# EAGLE design Salinity-FeatherWing (EAGLE 7.5.0)
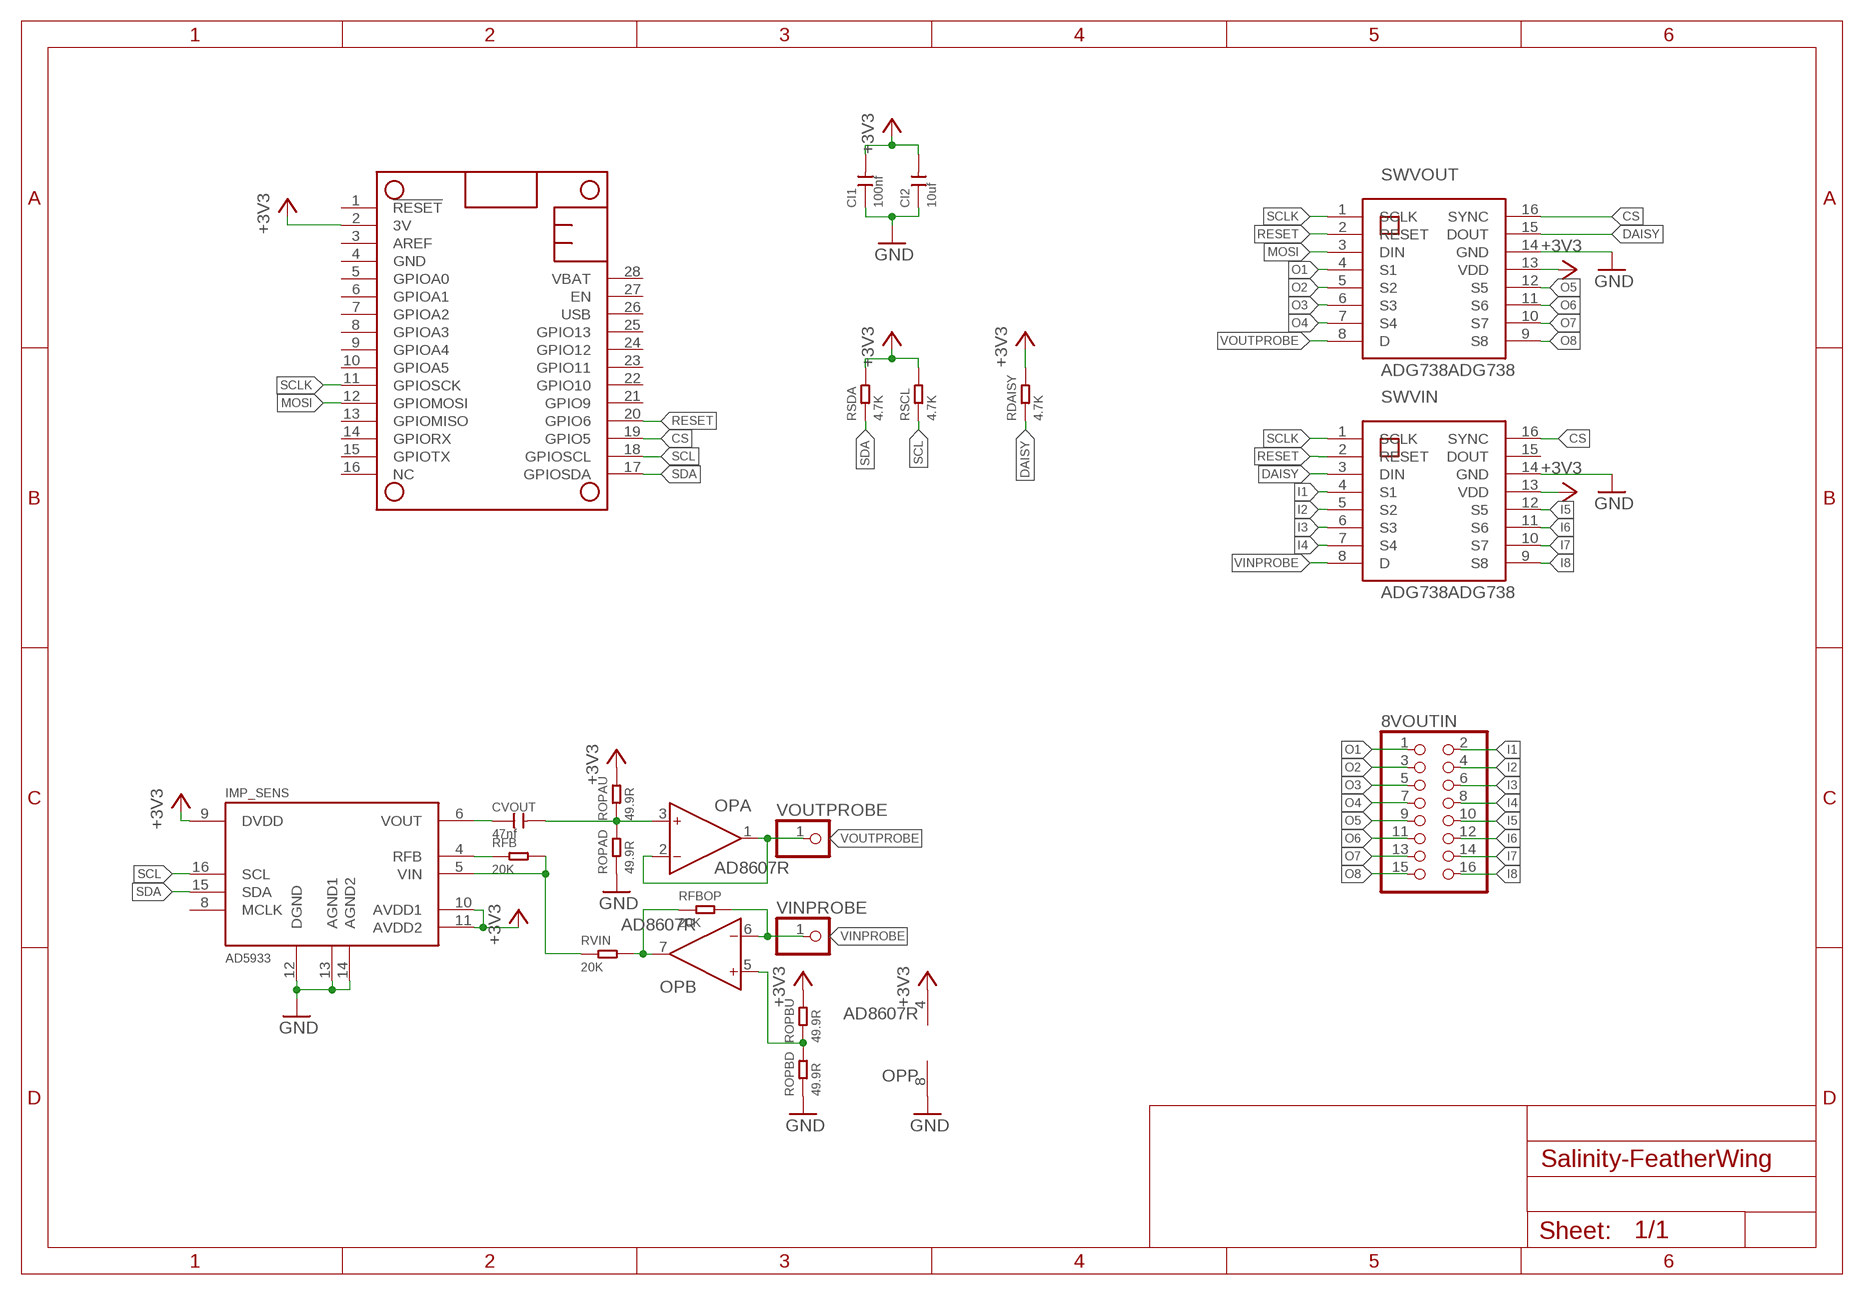
[diagram p0: schematic, sheet 1]

## Parts
8VOUTIN  PINHD-2X8/90  [2X08/90]
CI1  100nf  CERAMIC-100NF-50V-10%-X7R(0603)  [C0603]
CI2  10uf  CERAMIC-10UF-10V-10%-X5R(0603)  [C0603]
CVOUT  47nf  CERAMIC-47NF-25V-10%-X7R(0402)  [C0402]
IMP_SENS  AD5933  [SSOP16]
MS1  FEATHERWING  [FEATHERWING]
OP  AD8607R  [SO8]
RDAISY  4.7K  SMD-RES-4.7K-5%-1/10W(0603)  [R0603]
RFB  20K  SMD-RES-20K-1%-1/10W(0603)  [R0603]
RFBOP  20K  SMD-RES-20K-1%-1/10W(0603)  [R0603]
ROPAD  49.9R  SMD-RES-49.9R-1%-1/10W(0603)  [R0603]
ROPAU  49.9R  SMD-RES-49.9R-1%-1/10W(0603)  [R0603]
ROPBD  49.9R  SMD-RES-49.9R-1%-1/10W(0603)  [R0603]
ROPBU  49.9R  SMD-RES-49.9R-1%-1/10W(0603)  [R0603]
RSCL  4.7K  SMD-RES-4.7K-5%-1/10W(0603)  [R0603]
RSDA  4.7K  SMD-RES-4.7K-5%-1/10W(0603)  [R0603]
RVIN  20K  SMD-RES-20K-1%-1/10W(0603)  [R0603]
SWVIN  ADG738ADG738  [TSSOP16]
SWVOUT  ADG738ADG738  [TSSOP16]
VINPROBE  PINHD-1X1  [1X01]
VOUTPROBE  PINHD-1X1  [1X01]

## Nets
+3V3: CI1.2 CI2.2 IMP_SENS.9(DVDD) IMP_SENS.10(AVDD1) IMP_SENS.11(AVDD2) MS1.2(3V) OP.4(P:V-) RDAISY.2 ROPAU.2 ROPBU.2 RSCL.2 RSDA.2 SWVIN.13(VDD) SWVOUT.13(VDD)
CS: MS1.19(GPIO5) SWVIN.16(SYNC) SWVOUT.16(SYNC)
DAISY: RDAISY.1 SWVIN.3(DIN) SWVOUT.15(DOUT)
GND: CI1.1 CI2.1 IMP_SENS.12(DGND) IMP_SENS.13(AGND1) IMP_SENS.14(AGND2) OP.8(P:V+) ROPAD.1 ROPBD.1 SWVIN.14(GND) SWVOUT.14(GND)
I1: 8VOUTIN.2 SWVIN.4(S1)
I2: 8VOUTIN.4 SWVIN.5(S2)
I3: 8VOUTIN.6 SWVIN.6(S3)
I4: 8VOUTIN.8 SWVIN.7(S4)
I5: 8VOUTIN.10 SWVIN.12(S5)
I6: 8VOUTIN.12 SWVIN.11(S6)
I7: 8VOUTIN.14 SWVIN.10(S7)
I8: 8VOUTIN.16 SWVIN.9(S8)
MOSI: MS1.12(GPIOMOSI) SWVOUT.3(DIN)
N$2: OP.7(B:OUT) RFBOP.1 RVIN.2
N$4: IMP_SENS.4(RFB) RFB.1
N$5: IMP_SENS.5(VIN) RFB.2 RVIN.1
N$6: CVOUT.1 IMP_SENS.6(VOUT)
O1: 8VOUTIN.1 SWVOUT.4(S1)
O2: 8VOUTIN.3 SWVOUT.5(S2)
O3: 8VOUTIN.5 SWVOUT.6(S3)
O4: 8VOUTIN.7 SWVOUT.7(S4)
O5: 8VOUTIN.9 SWVOUT.12(S5)
O6: 8VOUTIN.11 SWVOUT.11(S6)
O7: 8VOUTIN.13 SWVOUT.10(S7)
O8: 8VOUTIN.15 SWVOUT.9(S8)
OPA+: CVOUT.2 OP.3(A:IN+) ROPAD.2 ROPAU.1
OPB+: OP.5(B:IN+) ROPBD.2 ROPBU.1
RESET: MS1.20(GPIO6) SWVIN.2(RESET) SWVOUT.2(RESET)
SCL: IMP_SENS.16(SCL) MS1.18(GPIOSCL) RSCL.1
SCLK: MS1.11(GPIOSCK) SWVIN.1(SCLK) SWVOUT.1(SCLK)
SDA: IMP_SENS.15(SDA) MS1.17(GPIOSDA) RSDA.1
VINPROBE: OP.6(B:IN-) RFBOP.2 SWVIN.8(D) VINPROBE.1
VOUTPROBE: OP.1(A:OUT) OP.2(A:IN-) SWVOUT.8(D) VOUTPROBE.1
Unconnected: IMP_SENS.8(MCLK) MS1.1(!RESET) MS1.3(AREF) MS1.5(GPIOA0) MS1.6(GPIOA1) MS1.7(GPIOA2) MS1.8(GPIOA3) MS1.9(GPIOA4) MS1.10(GPIOA5) MS1.13(GPIOMISO) MS1.14(GPIORX) MS1.15(GPIOTX) MS1.16(NC) MS1.21(GPIO9) MS1.22(GPIO10) MS1.23(GPIO11) MS1.24(GPIO12) MS1.25(GPIO13) MS1.26(USB) MS1.27(EN) MS1.28(VBAT) SWVIN.15(DOUT)

## Power pins joined to a net without a drawn wire
GND: MS1.4(GND)

## Library data of the parts
8VOUTIN = pinhead:PINHD-2X8: PIN HEADER
CI1 = Seeed-OPL-Capacitor:CERAMIC-100NF-50V-10%-X7R(0603): 302010138; MPN: CC0603KRX7R9BB104
CI2 = Seeed-OPL-Capacitor:CERAMIC-10UF-10V-10%-X5R(0603): 302010103; MPN: CC0603KRX5R6BB106
CVOUT = Seeed-OPL-Capacitor:CERAMIC-47NF-25V-10%-X7R(0402): 302010002; MPN: CC0402KRX7R8BB473
IMP_SENS = kblom:AD5933: 1 MSPS, 12-Bit Impedance Converter, Network Analyzer Applications: Electrochemical analysis Bioelectrical impedance analysis Impedance spectroscopy Complex impedance measurement Corrosion monitoring and protection equipment Biomedical and automotive sensors Proximity sensing Nondestructive testing Material property analysis Fuel/battery cell condition monitoring source <http://www.analog.com/static/imported-files/data_sheets/AD5933.pdf>
MS1 = adafruit:FEATHERWING
OP = analog-devices:AD8607: Precision Micropower, Low Noise CMOS, Rail-to-Rail Input/Output Operational Amplifiers Source: http://www.analog.com/static/imported-files/data_sheets/AD8603_8607_8609.pdf; MPN: AD8607ARMZ-R2; OC_FARNELL: 1651293; OC_NEWARK: 19M8927
RDAISY RSCL RSDA = Seeed-OPL-Resistor:SMD-RES-4.7K-5%-1/10W(0603): 301010290; MPN: RC0603JR-074K7L
RFB RFBOP RVIN = Seeed-OPL-Resistor:SMD-RES-20K-1%-1/10W(0603): 301010288; MPN: RC0603FR-0720KL
ROPAD ROPAU ROPBD ROPBU = Seeed-OPL-Resistor:SMD-RES-49.9R-1%-1/10W(0603): 301010296; MPN: RC0603FR-0749R9L
SWVIN SWVOUT = ADG738:ADG738
VINPROBE VOUTPROBE = adafruit:PINHD-1X1: Pin header 1x1 for 0.1" spacing With round pins

## Board
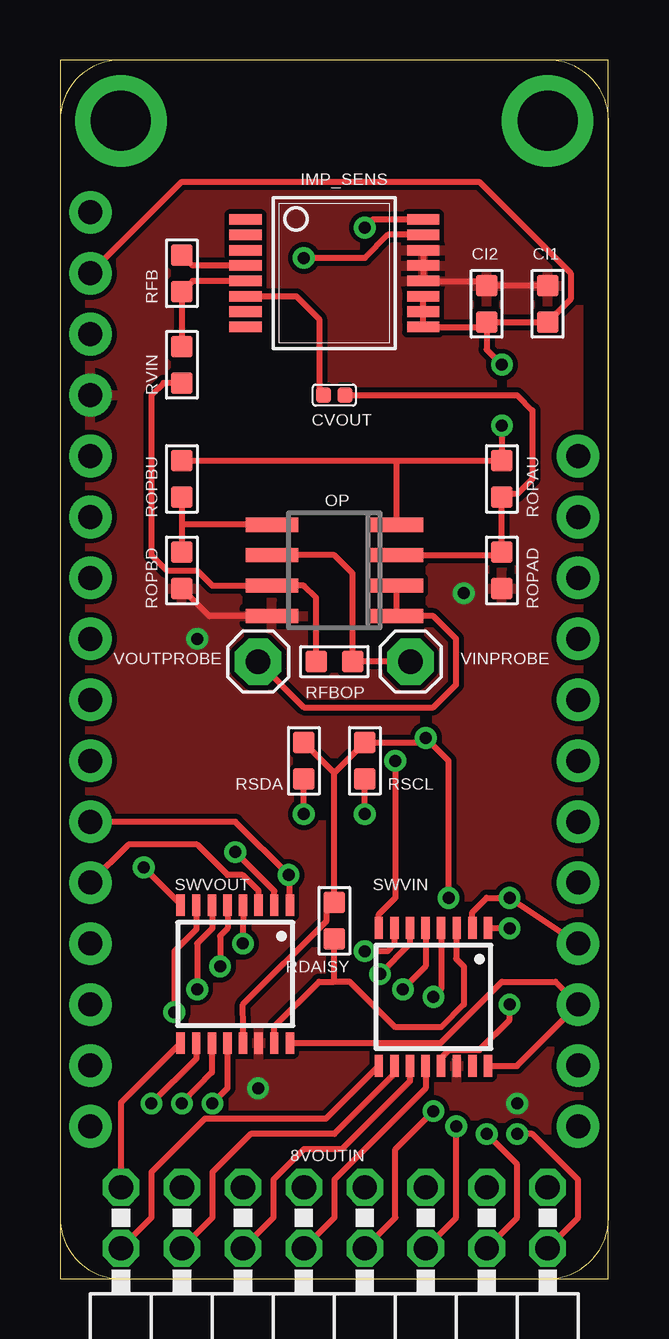
[diagram p1: board, top side]
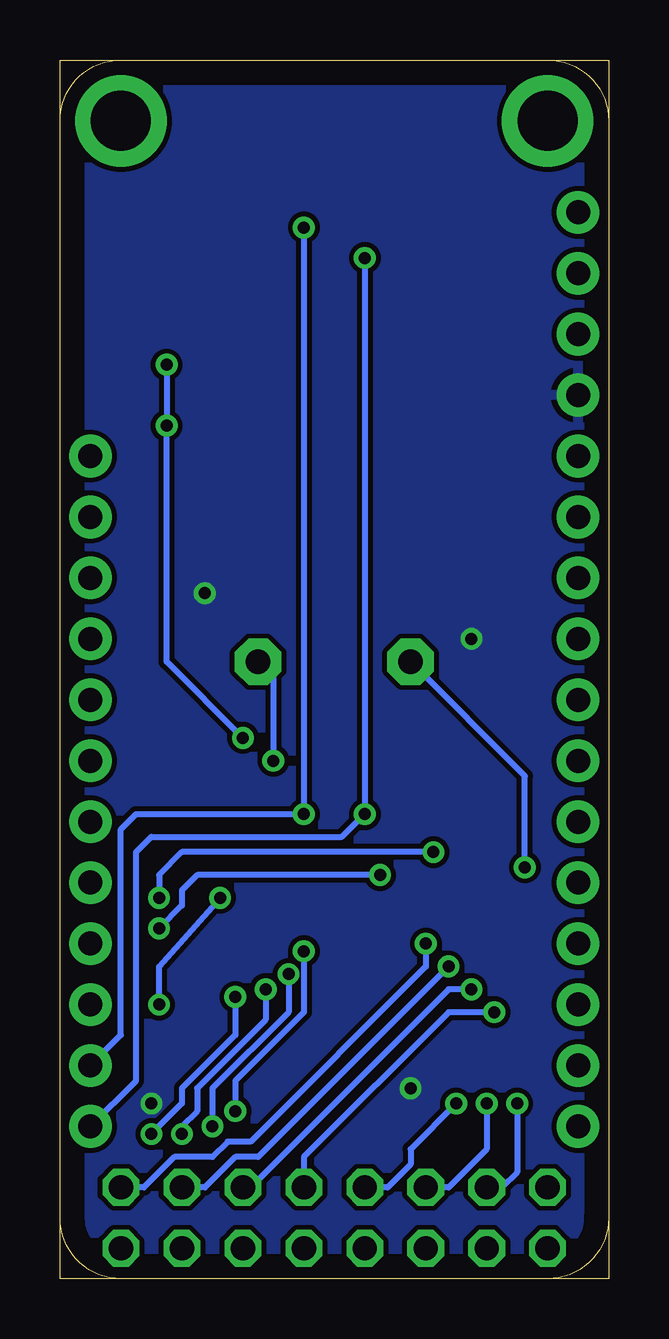
[diagram p2: board, bottom side, seen from below]

Size 22.86 x 50.8 mm. Coordinates in mm from the lower left corner, seen from the top.
Outline: 0,0 22.85,0 22.85,50.79 0,50.79 0,0
Copper layers (1*16): Top 0.035mm / dielectric 1.5mm / Bottom 0.035mm
Design rules "default": minimum track width 10mil, minimum drill 24mil, track to track 8mil, track to pad 8mil, pad to pad 8mil, via to via 8mil, smd to smd 8mil, copper to edge 40mil, drill to drill 8mil, minimum pad ring 10mil, minimum via ring 8mil, stop-mask expansion 4mil, vias tented up to drill 0mil, thermal gap 10mil

### Footprints (pad centres in the part's own frame; a part is rotated, then mirrored left to right if it is on the bottom)
2X08/90 = drill 1.016 octagon: 1 -8.89,-6.35; 2 -8.89,-3.81; 3 -6.35,-6.35; 4 -6.35,-3.81; 5 -3.81,-6.35; 6 -3.81,-3.81; 7 -1.27,-6.35; 8 -1.27,-3.81; 9 1.27,-6.35; 10 1.27,-3.81; 11 3.81,-6.35; 12 3.81,-3.81; 13 6.35,-6.35; 14 6.35,-3.81; 15 8.89,-6.35; 16 8.89,-3.81
C0603 = smd 0.889 x 0.889: 1 0,0.762; 2 0,-0.762
C0402 = smd 0.635 x 0.635: 1 0,0.445; 2 0,-0.445
SSOP16 = smd 0.44 x 1.34: 1 -2.24,-3.7; 2 -1.6,-3.7; 3 -0.96,-3.7; 4 -0.32,-3.7; 5 0.32,-3.7; 6 0.96,-3.7; 7 1.6,-3.7; 8 2.24,-3.7; 9 2.24,3.7; 10 1.6,3.7; 11 0.96,3.7; 12 0.32,3.7; 13 -0.32,3.7; 14 -0.96,3.7; 15 -1.6,3.7; 16 -2.24,3.7
FEATHERWING = drill 1 pad 1.778: 1 6.35,1.27; 2 8.89,1.27; 3 11.43,1.27; 4 13.97,1.27; 5 16.51,1.27; 6 19.05,1.27; 7 21.59,1.27; 8 24.13,1.27; 9 26.67,1.27; 10 29.21,1.27; 11 31.75,1.27; 12 34.29,1.27; 13 36.83,1.27; 14 39.37,1.27; 15 41.91,1.27; 16 44.45,1.27; 17 44.45,21.59; 18 41.91,21.59; 19 39.37,21.59; 20 36.83,21.59; 21 34.29,21.59; 22 31.75,21.59; 23 29.21,21.59; 24 26.67,21.59; 25 24.13,21.59; 26 21.59,21.59; 27 19.05,21.59; 28 16.51,21.59 | drill 2.5 pad 3.81: P$1 2.54,20.32; P$2 2.54,2.54
SO8 = smd 0.6 x 2.2: 1 -1.905,-2.6; 2 -0.635,-2.6; 3 0.635,-2.6; 4 1.905,-2.6; 5 1.905,2.6; 6 0.635,2.6; 7 -0.635,2.6; 8 -1.905,2.6
R0603 = smd 0.889 x 0.889: 1 0,0.762; 2 0,-0.762
TSSOP16 = smd 0.9 x 0.35: 1 -2.875,2.275; 2 -2.875,1.625; 3 -2.875,0.975; 4 -2.875,0.325; 5 -2.875,-0.325; 6 -2.875,-0.975; 7 -2.875,-1.625; 8 -2.875,-2.275; 9 2.875,-2.275; 10 2.875,-1.625; 11 2.875,-0.975; 12 2.875,-0.325; 13 2.875,0.325; 14 2.875,0.975; 15 2.875,1.625; 16 2.875,2.275
1X01 = drill 1.016 pad 1.93 octagon: 1 0,0

### Placement (x,y rotation side)
8VOUTIN  11.43,-2.54 180 top
CI1  20.32,40.64 0 top
CI2  17.78,40.64 0 top
CVOUT  11.43,36.83 90 top
IMP_SENS  11.43,41.91 270 top
MS1  0,50.8 270 top
OP  11.43,29.53 90 top
RDAISY  11.43,14.92 180 top
RFB  5.08,41.91 0 top
RFBOP  11.43,25.72 90 top
ROPAD  18.41,29.53 180 top
ROPAU  18.41,33.34 180 top
ROPBD  5.08,29.53 180 top
ROPBU  5.08,33.34 180 top
RSCL  12.7,21.59 180 top
RSDA  10.16,21.59 180 top
RVIN  5.08,38.1 0 top
SWVIN  15.56,11.75 270 top
SWVOUT  7.3,12.7 270 top
VINPROBE  14.61,25.72 90 top
VOUTPROBE  8.26,25.72 90 top

### Tracks (layer width: path | path; a pad name or v marks a point on that pad's centre or on a via)
+3V3  (via drill 0.5)
  Top 0.254: 17.57,39.67 IMP_SENS.9 IMP_SENS.10 IMP_SENS.11 | 17.57,39.67 CI2.2 CI1.2 21.27,40.83 21.27,41.91 17.46,45.72 5.08,45.72 MS1.2 | ROPBU.2 13.97,34.1 | 13.97,34.1 ROPAU.2 v18.41,35.56 | OP.4 14.03,34.04 13.97,34.1 | 17.57,39.67 17.57,39.8 17.78,40.01 17.78,38.73 v18.41,38.1 | RSDA.2 11.43,21.08 | 11.43,21.08 RSCL.2 15.05,22.35 v15.24,22.54 16.19,21.59 v16.19,15.88 | SWVIN.13 15.87,8.58 15.88,9.21 16.19,9.53 17.47,9.53 18.73,10.79 v18.73,11.43 | 11.56,15.56 RDAISY.2 | RDAISY.2 11.43,21.08 | SWVOUT.13 7.63,10.48 7.62,11.43 11.11,14.92 11.11,15.56 11.24,15.56 RDAISY.2
  Bottom 0.254: v18.41,38.1 v18.41,35.56 18.41,25.72 v15.24,22.54 | v18.73,11.43 18.73,13.02 v16.19,15.88
CS
  Top 0.254: SWVOUT.16 15.86,9.82 18.41,12.38 20.64,12.38 MS1.19 19.03,8.87 SWVIN.16
DAISY
  Top 0.254: SWVOUT.15 8.93,10.52 10.79,12.38 11.43,12.38 | 11.43,12.38 11.43,13.97 | 11.43,13.97 11.15,14.25 11.15,14.32 11.11,14.29 11.3,14.29 RDAISY.1 11.43,13.97 | SWVIN.3 16.51,14.6 16.51,13.34 16.83,13.02 16.83,11.43 15.88,10.48 13.97,10.48 12.06,12.38 11.43,12.38
GND  (via drill 0.5)
  Top 0.254: OP.8 6.22,27.62 ROPBD.1 | IMP_SENS.14 IMP_SENS.13 IMP_SENS.12 17.59,41.59 CI2.1 CI1.1
  other vias: 8.26,7.94 19.05,7.3 5.71,26.67 16.83,28.57
  pour Bottom: 0,50.8 0,0 22.86,0 22.86,50.8
  pour Top: 0,50.8 0,0 22.86,0 22.86,50.8
I1  (via drill 0.5)
  Top 0.254: SWVIN.4 15.88,12.07 v15.56,11.75 | 8VOUTIN.2 21.59,2.54 21.59,4.13 19.68,6.03 v19.05,6.03
  Bottom 0.254: v15.56,11.75 15.56,10.16 17.78,7.94 17.78,7.3 v19.05,6.03
I2  (via drill 0.5)
  Top 0.254: SWVIN.5 15.23,13.03 14.29,12.07 v14.29,12.06 | 8VOUTIN.4 19.05,2.54 19.05,4.76 v17.78,6.03
  Bottom 0.254: v14.29,12.06 14.29,10.79 17.14,7.94 17.14,6.99 17.78,6.35 v17.78,6.03
I3  (via drill 0.5)
  Top 0.254: SWVIN.6 14.58,13.95 v13.34,12.7 | 8VOUTIN.6 16.51,2.54 v16.51,6.35
  Bottom 0.254: v13.34,12.7 13.34,11.11 16.51,7.94 v16.51,6.35
I4  (via drill 0.5)
  Top 0.254: SWVIN.7 13.93,13.93 13.65,13.65 v12.7,13.65 | 8VOUTIN.8 13.97,2.54 13.97,5.4 v15.56,6.99
  Bottom 0.254: v12.7,13.65 12.7,11.11 15.56,8.26 v15.56,6.99
I5
  Top 0.254: SWVIN.12 15.23,7.93 11.43,4.13 11.43,2.54 8VOUTIN.10
I6
  Top 0.254: SWVIN.11 14.58,8.23 11.75,5.4 10.16,5.4 8.89,4.13 8.89,2.54 8VOUTIN.12
I7
  Top 0.254: SWVIN.10 13.93,8.54 11.43,6.03 7.94,6.03 6.35,4.45 6.35,2.54 8VOUTIN.14
I8
  Top 0.254: 8VOUTIN.16 3.81,2.54 3.81,4.45 6.03,6.67 11.08,6.67 SWVIN.9
MOSI
  Top 0.254: SWVOUT.3 8.28,16.17 7.62,16.83 6.99,16.83 5.71,18.1 2.86,18.1 MS1.12
N$2
  Top 0.254: RFBOP.1 10.67,28.38 10.16,28.89 OP.7 6.35,28.89 5.71,29.53 4.45,29.53 3.81,30.16 3.81,36.83 4.32,37.34 RVIN.2
N$4
  Top 0.254: IMP_SENS.4 5.52,42.23 RFB.1
N$5
  Top 0.254: IMP_SENS.5 5.52,41.59 RFB.2 RVIN.1
N$6
  Top 0.254: IMP_SENS.6 9.85,40.95 10.79,40.01 10.79,37.02 CVOUT.1
O1  (via drill 0.5)
  Top 0.254: SWVOUT.4 v7.62,13.97
  Bottom 0.254: v7.62,13.97 7.62,13.02 14.92,5.71 15.88,5.71 16.51,5.08 18.1,5.08 19.37,3.81 8VOUTIN.1
O2  (via drill 0.5)
  Top 0.254: SWVOUT.5 6.99,14.61 6.67,14.29 v6.67,13.02
  Bottom 0.254: v6.67,13.02 14.61,5.08 15.56,5.08 16.83,3.81 8VOUTIN.3
O3  (via drill 0.5)
  Top 0.254: SWVOUT.6 6.35,14.61 5.71,13.97 v5.71,12.06
  Bottom 0.254: v5.71,12.06 6.67,12.06 14.92,3.81 8VOUTIN.5
O4  (via drill 0.5)
  Top 0.254: SWVOUT.7 5.68,14.57 4.76,13.65 v4.76,11.11
  Bottom 0.254: v4.76,11.11 6.67,11.11 12.7,5.08 8VOUTIN.7
O5  (via drill 0.5)
  Top 0.254: SWVOUT.12 6.98,7.95 v6.35,7.3
  Bottom 0.254: v6.35,7.3 8.26,5.4 8.26,4.76 9.21,3.81 8VOUTIN.9
O6  (via drill 0.5)
  Top 0.254: SWVOUT.11 6.33,8.6 v5.08,7.3
  Bottom 0.254: v5.08,7.3 5.08,5.4 6.67,3.81 8VOUTIN.11
O7  (via drill 0.5)
  Top 0.254: SWVOUT.10 5.68,9.17 v3.81,7.3
  Bottom 0.254: v3.81,7.3 3.81,4.45 4.45,3.81 8VOUTIN.13
O8
  Top 0.254: SWVOUT.9 2.54,7.34 8VOUTIN.15
OPA+
  Top 0.254: OP.3 18.29,30.16 ROPAD.2 ROPAU.1 18.54,32.7 19.05,32.7 19.68,33.34 19.68,36.2 19.05,36.83 CVOUT.2
OPB+
  Top 0.254: ROPBU.1 5.08,31.43 | 5.08,31.43 ROPBD.2 | OP.5 5.08,31.43
RESET  (via drill 0.5)
  Top 0.254: MS1.20 v18.73,15.88 17.78,15.88 17.18,15.28 SWVIN.2 | SWVOUT.2 8.93,16.16 v7.3,17.78
  Bottom 0.254: v7.3,17.78 17.78,17.78 18.73,16.83 v18.73,15.88
SCL  (via drill 0.5)
  Top 0.254: IMP_SENS.16 13.04,44.15 v12.7,43.81 | v12.7,19.37 RSCL.1
  Bottom 0.254: MS1.18 20.32,10.16 20.32,18.73 19.68,19.37 v12.7,19.37 v12.7,43.81
SCLK  (via drill 0.5)
  Top 0.254: MS1.11 7.3,19.05 v9.53,16.83 9.58,16.77 SWVOUT.1 | SWVIN.1 18.71,14.62 v18.73,14.61
  Bottom 0.254: v9.53,16.83 17.14,16.83 17.78,16.19 17.78,15.56 v18.73,14.61
SDA  (via drill 0.5)
  Top 0.254: v10.16,19.37 RSDA.1 | IMP_SENS.15 13.66,43.51 12.7,42.55 v10.16,42.55
  Bottom 0.254: MS1.17 19.68,8.26 19.68,17.78 19.05,18.41 11.11,18.41 v10.16,19.37 v10.16,42.55
VINPROBE  (via drill 0.5)
  Top 0.254: OP.6 11.43,30.16 12.19,29.4 RFBOP.2 VINPROBE.1 | v13.97,21.59 13.97,15.88 13.28,15.19 SWVIN.8
  Bottom 0.254: VINPROBE.1 13.97,25.08 v13.97,21.59
VOUTPROBE  (via drill 0.5)
  Top 0.254: OP.2 OP.1 15.56,27.62 16.51,26.67 16.51,24.77 15.56,23.81 10.16,23.81 VOUTPROBE.1 | SWVOUT.8 5.03,15.61 v3.49,17.14
  Bottom 0.254: v3.49,17.14 3.49,20.95 VOUTPROBE.1